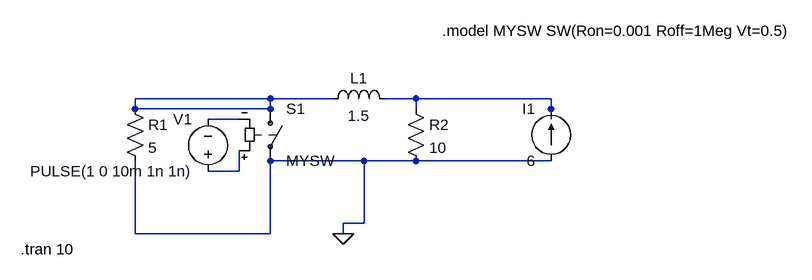
[diagram p0: schematic Draft1.asc]
Draft1.asc, the LTspice schematic file:
Version 4
SHEET 1 1116 680
WIRE 272 144 64 144
WIRE 368 144 272 144
WIRE 496 144 448 144
WIRE 704 144 496 144
WIRE 64 160 64 144
WIRE 272 160 272 144
WIRE 272 160 64 160
WIRE 496 160 496 144
WIRE 704 160 704 144
WIRE 224 176 176 176
WIRE 704 176 704 160
WIRE 416 240 272 240
WIRE 496 240 416 240
WIRE 704 240 496 240
WIRE 224 256 224 224
WIRE 224 256 176 256
WIRE 416 336 416 240
WIRE 416 336 384 336
WIRE 64 352 64 240
WIRE 272 352 272 240
WIRE 272 352 64 352
WIRE 384 352 384 336
FLAG 384 352 0
SYMBOL res 48 144 R0
SYMATTR InstName R1
SYMATTR Value 5
SYMBOL res 480 144 R0
SYMATTR InstName R2
SYMATTR Value 10
SYMBOL current 704 240 R180
WINDOW 0 24 80 Left 2
WINDOW 3 24 0 Left 2
SYMATTR InstName I1
SYMATTR Value 6
SYMBOL ind 352 160 R270
WINDOW 0 32 56 VTop 2
WINDOW 3 5 56 VBottom 2
SYMATTR InstName L1
SYMATTR Value 1.5
SYMBOL sw 272 144 R0
SYMATTR InstName S1
SYMATTR Value MYSW
SYMBOL voltage 176 272 R180
WINDOW 0 24 96 Left 2
WINDOW 3 24 16 Left 2
WINDOW 123 0 0 Left 0
WINDOW 39 0 0 Left 0
SYMATTR InstName V1
SYMATTR Value PULSE(1 0 10m 1n 1n)
TEXT 536 40 Left 2 !.model MYSW SW(Ron=0.001 Roff=1Meg Vt=0.5)
TEXT -112 376 Left 2 !.tran 10

The netlist it stands for:
* Draft1.asc
R1 N001 0 5
R2 N002 0 10
I1 0 N002 6
L1 N001 N002 1.5
S1 N001 0 N004 N003 MYSW
V1 N004 N003 PULSE(1 0 10m 1n 1n)
.model MYSW SW(Ron=0.001 Roff=1Meg Vt=0.5)
.tran 10
.backanno
.end